# EAGLE design RFM69HCW_BREAKOUT (EAGLE 7.2.0)
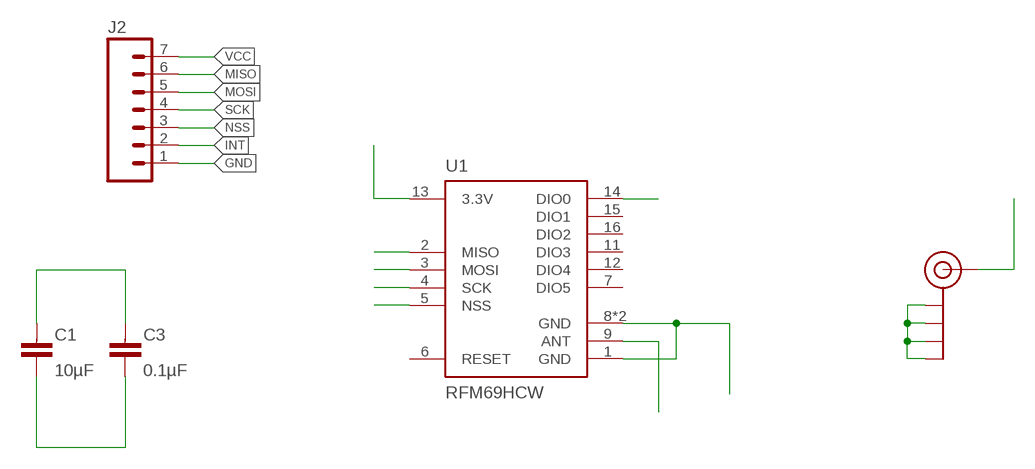
[diagram p0: schematic, sheet 1]

## Parts
C1  10µF  CAPACITOR0805-N  [C0805-N]
C3  0.1µF  CAPACITOR0603-N  [C0603-N]
J2  M07  [1X07]
J$1  SMA_EDGE  [SMA-EDGE]
U1  RFM69HCW  [RFM69HCW-XXXS2]

## Nets
ANT: J$1.SIG(SIGNAL) U1.9(ANT)
GND: C1.2 C3.2 J2.1 J$1.GND@0(GND) J$1.GND@1(GND) J$1.GND@2(GND) J$1.GND@3(GND) U1.1(GND) U1.8(GND) U1.10(GND)
INT: J2.2 U1.14(DIO0)
MISO: J2.6 U1.2(MISO)
MOSI: J2.5 U1.3(MOSI)
NSS: J2.3 U1.5(NSS)
SCK: J2.4 U1.4(SCK)
VCC: C1.1 C3.1 J2.7 U1.13(3.3V)
Unconnected: U1.6(RESET) U1.7(DIO5) U1.11(DIO3) U1.12(DIO4) U1.15(DIO1) U1.16(DIO2)

## Library data of the parts
C1 C3 = passives-7351:CAPACITOR
J2 = SparkFun-Connectors:M07: Header 7 Standard 7-pin 0.1" header. Use with straight break away headers (SKU : PRT-00116), right angle break away headers (PRT-00553), swiss pins (PRT-00743), machine pins (PRT-00117), and female headers (PRT-00115). NOTES ON THE VARIANTS LOCK and LOCK_LONGPADS... This footprint was designed to help hold the alignment of a through-hole component (i.e. 7-pin header) while soldering it into place. You may notice that each hole has been shifted either up or down by 0.005 of an inch from it's more standard position (which is usually a perfectly straight line). This slight alteration caused the pins (the squares in the middle) to touch the edges of the holes. Because they are alternating, it causes a "brace" to hold the header in place. 0.005 has proven to be the perfect amount of "off-center" position when using our standard breakaway headers. Although looks a little odd when you look at the bare footprint, once you have a header in there, the alteration is very hard to notice. Also, if you push a header all the way into place, it is covered up entirely on the bottom side. This idea of altering the position of holes to aid alignment will be further integrated into the Sparkfun Library for other footprints. It can help hold any component with 3 or more connection pins.
J$1 = SparkFun-Connectors:SMA_EDGE: SMA Antenna Connector End launch SMA connector. The paste layer has been removed so that the connector can be hand soldered onto the board after reflow.
U1 = SparkFun-RF:RFM69H; PROD_ID: IC-11997, IC-12053

## Board
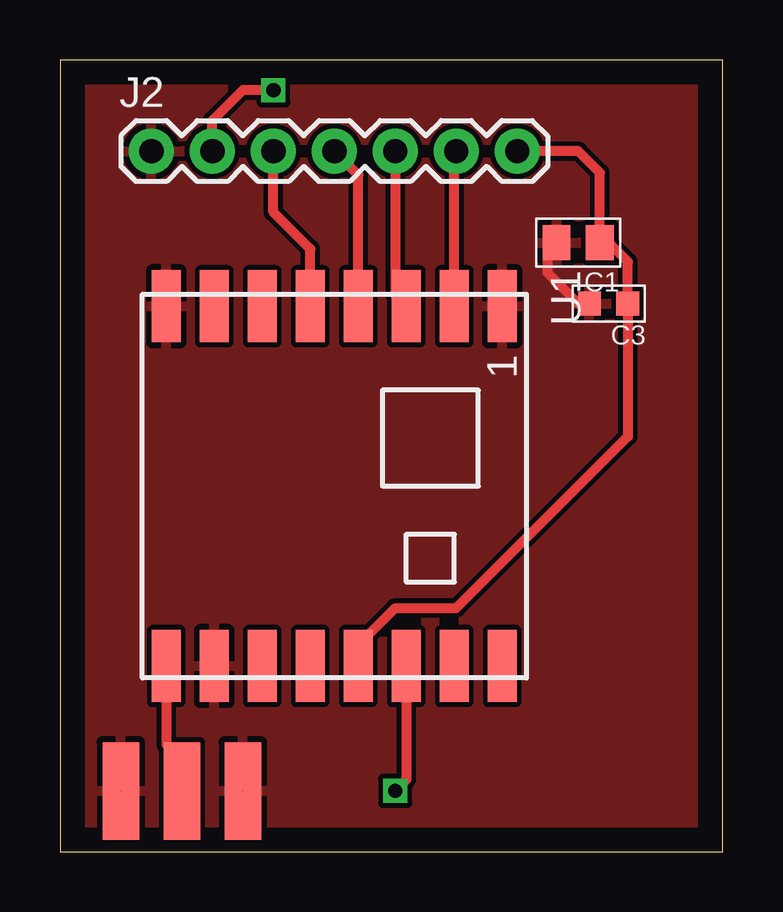
[diagram p1: board, top side]
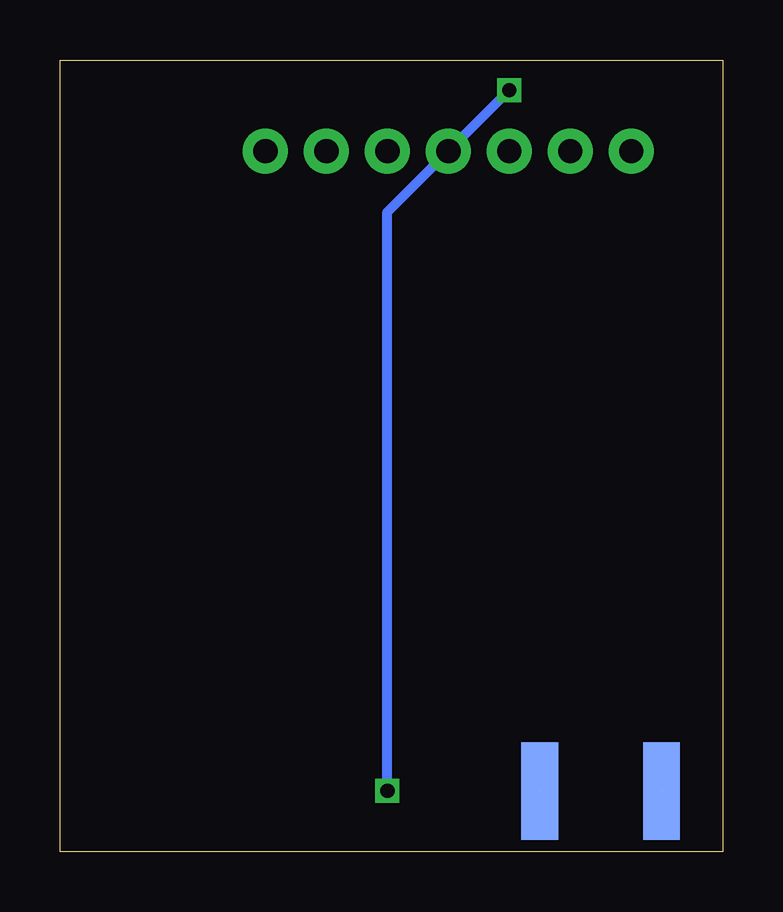
[diagram p2: board, bottom side, seen from below]

Size 27.61 x 33.01 mm. Coordinates in mm from the lower left corner, seen from the top.
Outline: 0,0 27.61,0 27.61,33.01 0,33.01 0,0
Copper layers (1*16): Top 0.035mm / dielectric 1.5mm / Bottom 0.035mm
Design rules "default": minimum track width 10mil, minimum drill 24mil, track to track 8mil, track to pad 8mil, pad to pad 8mil, via to via 8mil, smd to smd 8mil, copper to edge 40mil, drill to drill 8mil, minimum pad ring 10mil, minimum via ring 8mil, stop-mask expansion 4mil, vias tented up to drill 0mil, thermal gap 10mil

### Footprints (pad centres in the part's own frame; a part is rotated, then mirrored left to right if it is on the bottom)
C0805-N = smd 1.15 x 1.45: 1 -0.9,0; 2 0.9,0
C0603-N = smd 0.95 x 1: 1 -0.8,0; 2 0.8,0
1X07 = drill 1.016 pad 1.88: 1 0,0; 2 2.54,0; 3 5.08,0; 4 7.62,0; 5 10.16,0; 6 12.7,0; 7 15.24,0
SMA-EDGE = smd 1.524 x 4.064: GND@0 0,0; GND@1 5.08,0; SIG 2.54,0 | smd 1.524 x 4.064 bottom: GND@2 0,0; GND@3 5.08,0
RFM69HCW-XXXS2 = smd 3 x 1.2: 1 -7.5,7; 2 -7.5,5; 3 -7.5,3; 4 -7.5,1; 5 -7.5,-1; 6 -7.5,-3; 7 -7.5,-5; 8 -7.5,-7; 9 7.5,-7; 10 7.5,-5; 11 7.5,-3; 12 7.5,-1; 13 7.5,1; 14 7.5,3; 15 7.5,5; 16 7.5,7

### Placement (x,y rotation side)
C1  21.59,25.4 180 top
C3  22.86,22.86 180 top
J2  3.81,29.21 0 top
J$1  7.62,2.54 180 top
U1  11.43,15.24 270 top

### Tracks (layer width: path | path; a pad name or v marks a point on that pad's centre or on a via)
ANT
  Top 0.406: U1.9 4.43,4.46 5.08,3.81 J$1.SIG
GND  (2 unrouted)
  Top 0.406: C3.2 21.59,22.86 20.32,24.13 20.32,25.03 C1.2
  pour Top: 0,0 27.94,0 27.94,33.02 0,33.02
INT  (via drill 0.6)
  Top 0.406: J2.2 6.35,30.48 7.62,31.75 v8.89,31.75 | U1.14 14.43,3 v13.97,2.54
  Bottom 0.406: v13.97,2.54 13.97,26.67 v8.89,31.75
MISO
  Top 0.406: U1.2 16.43,29.13 J2.6
MOSI
  Top 0.406: J2.5 13.97,23.2 U1.3
NSS
  Top 0.406: U1.5 10.43,25.13 8.89,26.67 J2.3
SCK
  Top 0.406: U1.4 12.43,28.21 J2.4
VCC
  Top 0.406: J2.7 21.59,29.21 22.49,28.31 C1.1 22.86,25.4 23.66,24.6 C3.1 23.66,17.31 16.51,10.16 13.97,10.16 12.43,8.62 U1.13